# Altium schematic sheet Table of Contents and Information.SchDoc: Overview
size Tabloid; Author: Krutav Shah; DrawnBy: Krutav Shah; SheetNumber: 1; SheetTotal: 5
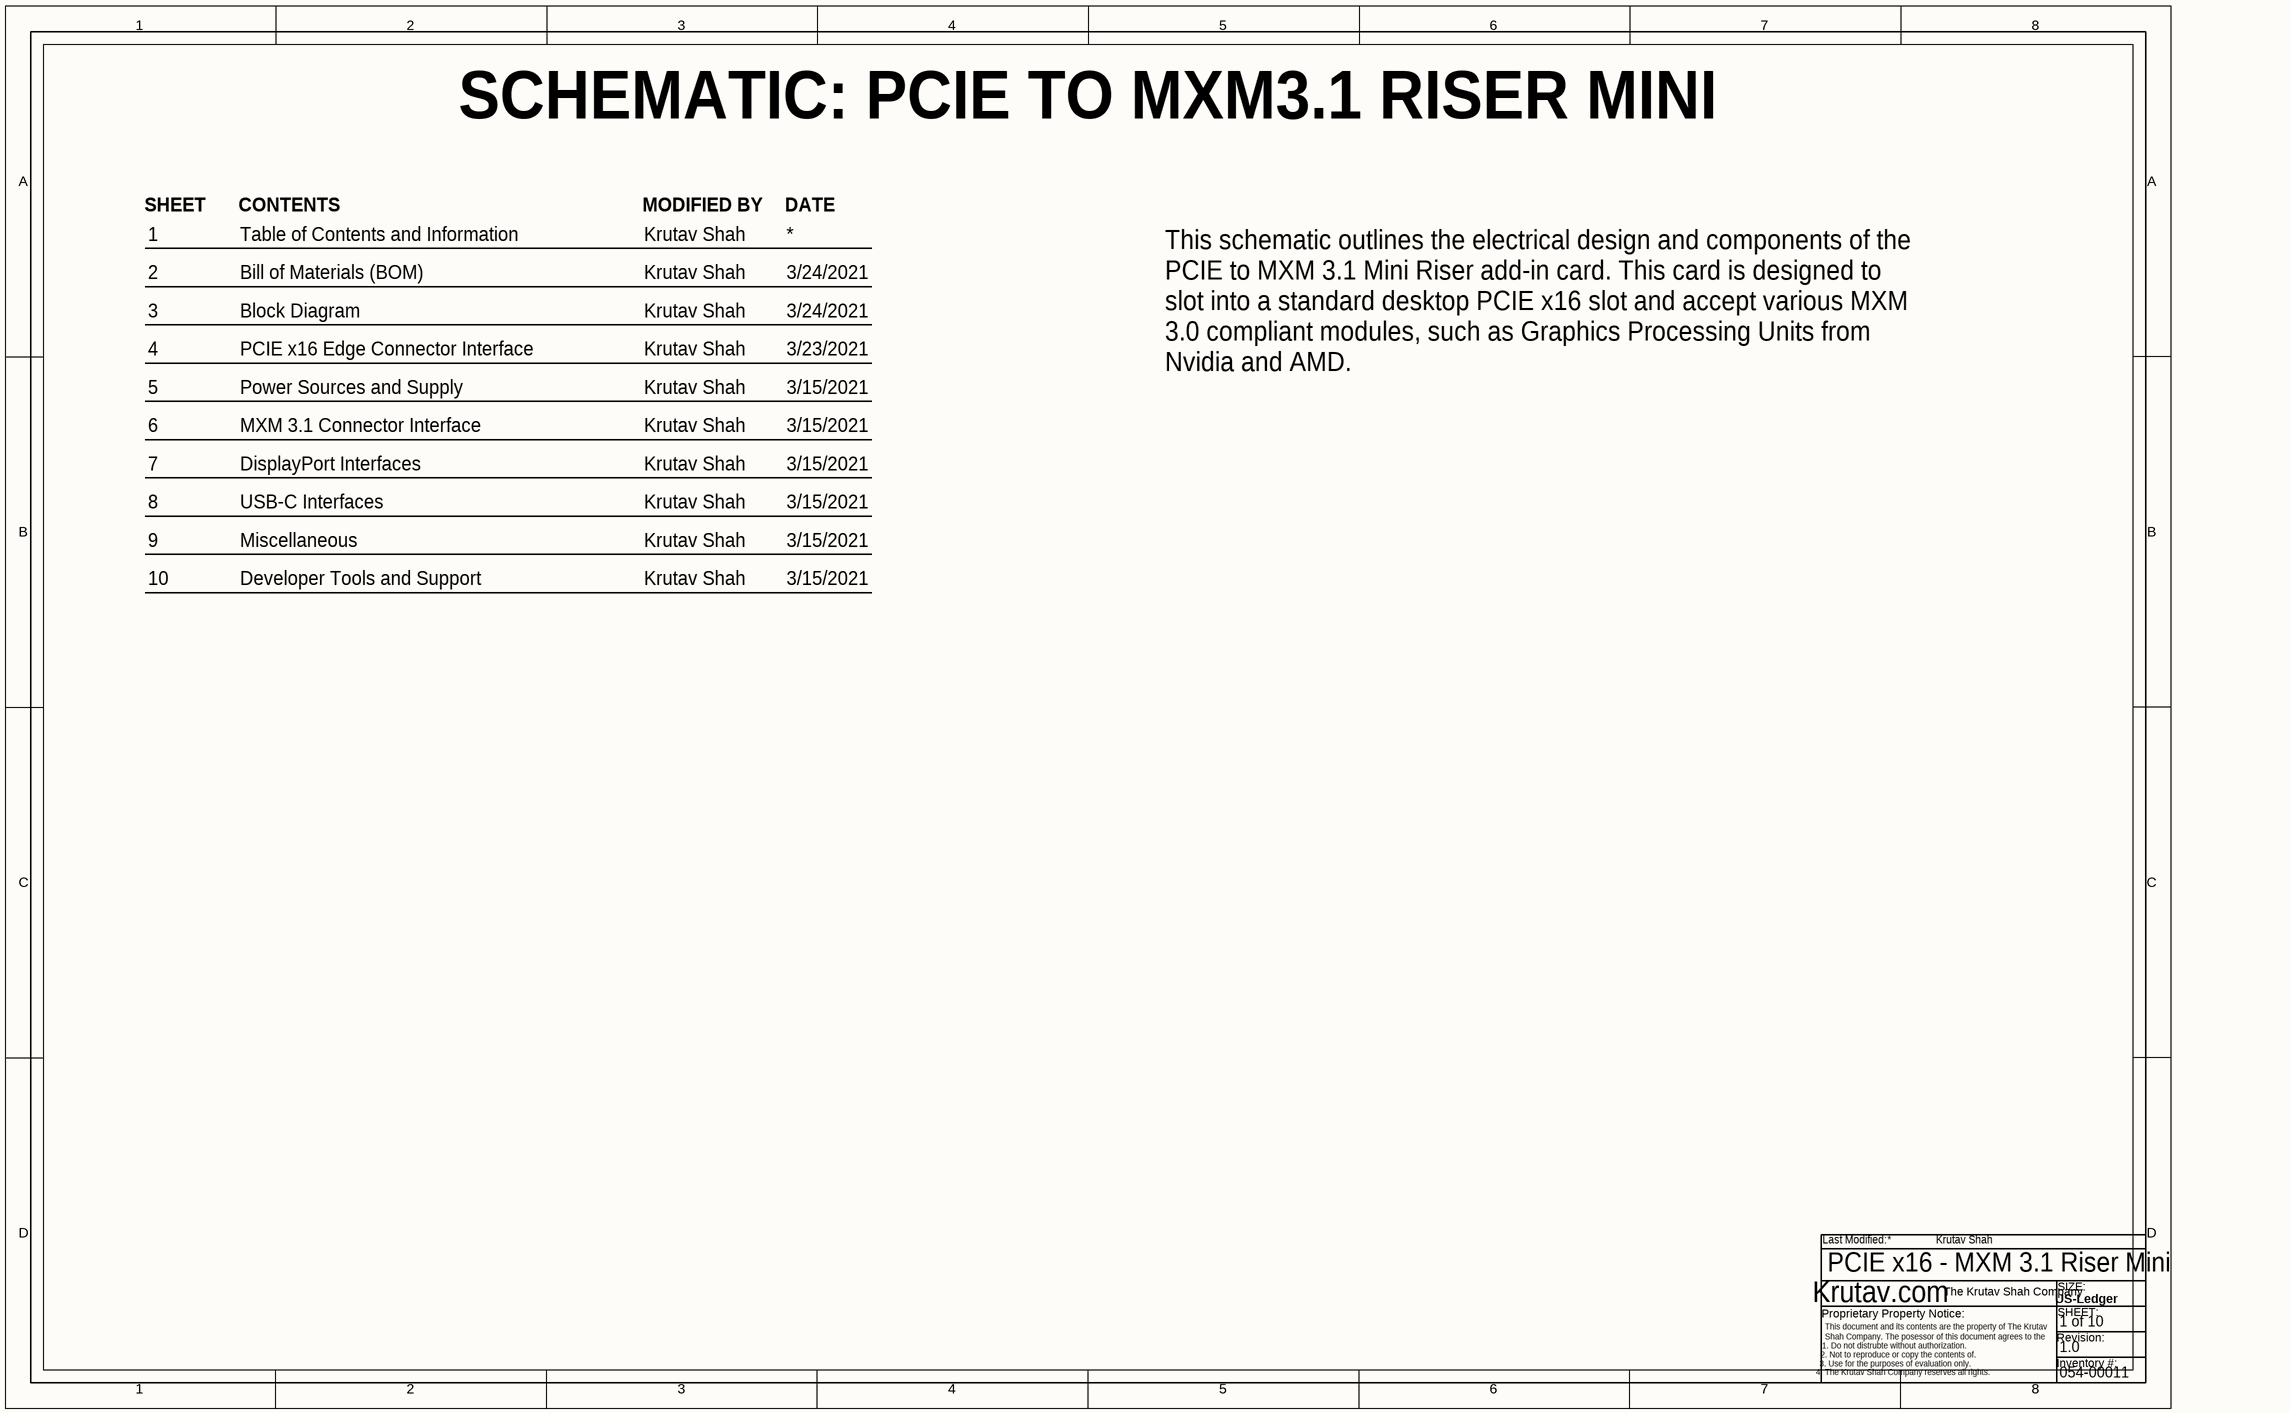
[diagram p0: Table of Contents and Information.SchDoc]

## Notes on the sheet
- SCHEMATIC: PCIE TO MXM3.1 RISER MINI
- SHEET
- CONTENTS
- MODIFIED BY
- DATE
- 1
- 2
- Table of Contents and Information
- Bill of Materials (BOM)
- 3/24/2021
- 3
- Block Diagram
- 4
- 5
- PCIE x16 Edge Connector Interface
- Power Sources and Supply
- 3/23/2021
- 3/15/2021
- 6
- 7
- MXM 3.1 Connector Interface
- DisplayPort Interfaces
- 8
- USB-C Interfaces
- 9
- 10
- Miscellaneous
- Developer Tools and Support
- This schematic outlines the electrical design and components of the PCIE to MXM 3.1 Mini Riser add-in card. This card is designed to slot into a standard desktop PCIE x16 slot and accept various MXM 3.0 compliant modules, such as Graphics Processing Units from Nvidia and AMD.
- PCIE x16 - MXM 3.1 Riser Mini
- 1 of 10
- 1.0
- 054-00011
- Last Modified:
- Krutav.com
- The Krutav Shah Company
- SIZE:
- SHEET:
- US-Ledger
- This document and its contents are the property of The Krutav Shah Company. The posessor of this document agrees to the following:
- Proprietary Property Notice:
- 1. Do not distrubte without authorization.
- 3. Use for the purposes of evaluation only.
- 2. Not to reproduce or copy the contents of.
- 4. The Krutav Shah Company reserves all rights.
- Revision:
- Inventory #: